# Altium project Encoder_PCB.PrjPcb
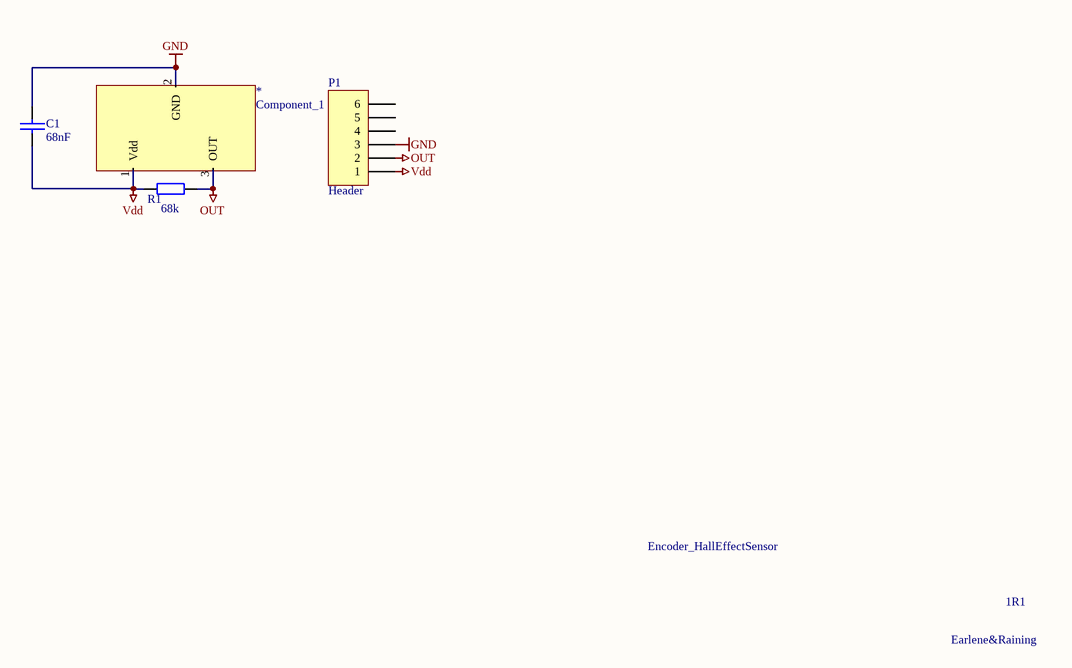
[diagram p0: HallEffectSensor.SchDoc]
1 sheet, 4 parts. Net scope: global (net labels, ports and power ports of the same name join across sheets).
Board file: HallEffectSensor.PcbDoc

## Sheet HallEffectSensor.SchDoc
size A4

### Parts
AH374  Component_1  [Component_1]
C1  68nF  [C1206]
P1  Header  [HDR1X6]
R1  value 68k  [R0805]  (hidden comment: Resistor 0805)

### Nets
GND: AH374.2(GND) C1.2 P1.3
OUT: AH374.3(OUT) P1.2 R1.2
Vdd: AH374.1(Vdd) C1.1 P1.1 R1.1

Not connected (* = marked no-connect by the designer): P1 4 5 6

### Notes on the sheet
- Encoder_HallEffectSensor
- 1R1
- Earlene&Raining

### Library data of the parts
C1 = CCAP0805: Type: Surface Mount; MPN: 68nF; Part Description: ?; Value: ?
P1 = Header 6: Header, 6-Pin; LatestRevisionDate: 17-Jul-2002; LatestRevisionNote: Re-released for DXP Platform.; Publisher: Altium Limited
R1 = RES0805: MPN: ?; Part Description: ?; Type: Surface Mount